# EAGLE design Sauna (EAGLE 9.5.1)
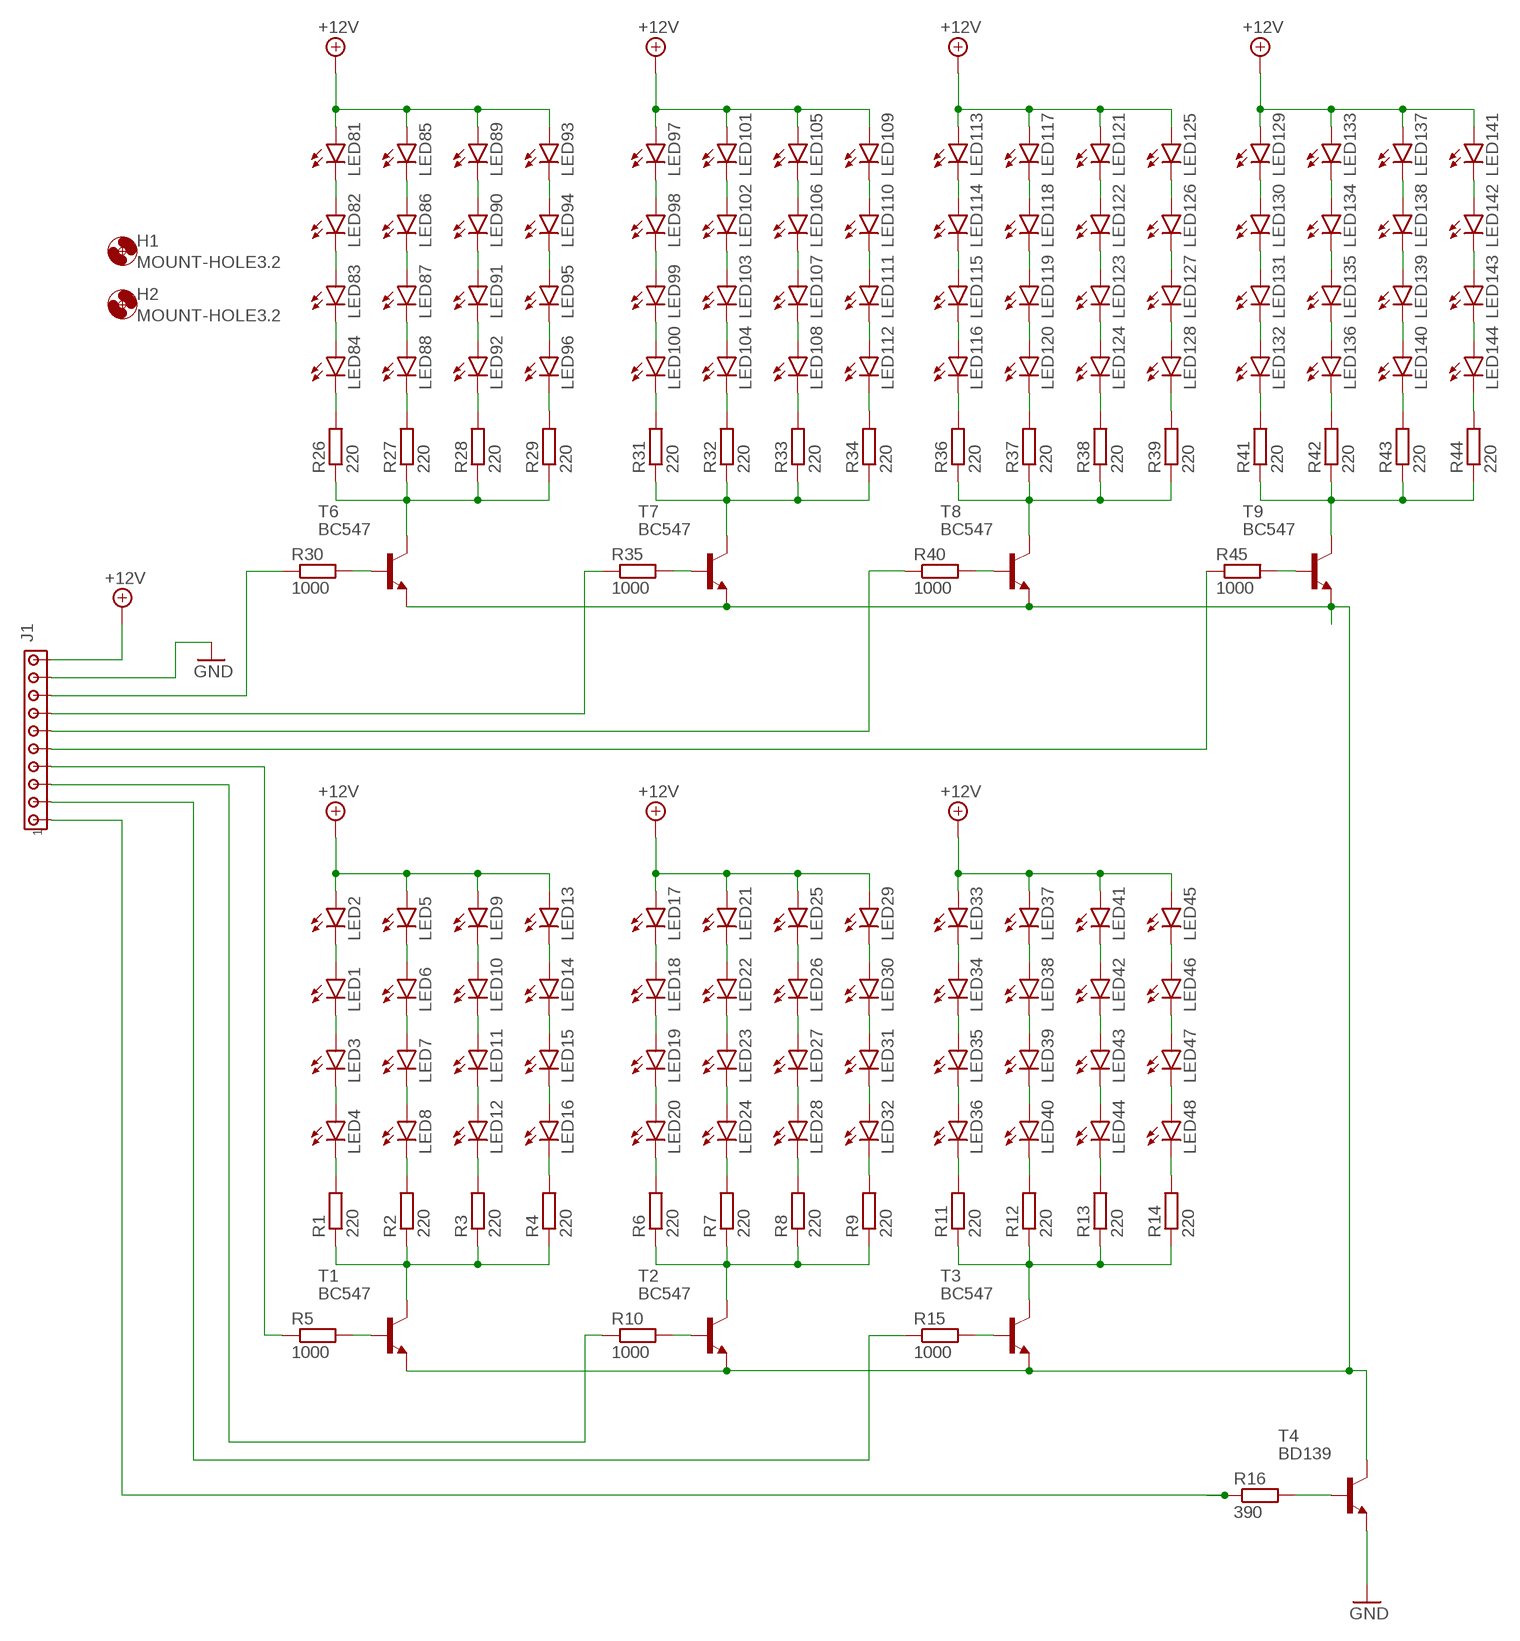
[diagram p0: schematic, sheet 1]

## Parts
H1  MOUNT-HOLE3.2  [3,2]
H2  MOUNT-HOLE3.2  [3,2]
J1  MTA10-100  [10X10MTA]
LED1  LED5MM  [LED5MM]
LED2  LED5MM  [LED5MM]
LED3  LED5MM  [LED5MM]
LED4  LED5MM  [LED5MM]
LED5  LED5MM  [LED5MM]
LED6  LED5MM  [LED5MM]
LED7  LED5MM  [LED5MM]
LED8  LED5MM  [LED5MM]
LED9  LED5MM  [LED5MM]
LED10  LED5MM  [LED5MM]
LED11  LED5MM  [LED5MM]
LED12  LED5MM  [LED5MM]
LED13  LED5MM  [LED5MM]
LED14  LED5MM  [LED5MM]
LED15  LED5MM  [LED5MM]
LED16  LED5MM  [LED5MM]
LED17  LED5MM  [LED5MM]
LED18  LED5MM  [LED5MM]
LED19  LED5MM  [LED5MM]
LED20  LED5MM  [LED5MM]
LED21  LED5MM  [LED5MM]
LED22  LED5MM  [LED5MM]
LED23  LED5MM  [LED5MM]
LED24  LED5MM  [LED5MM]
LED25  LED5MM  [LED5MM]
LED26  LED5MM  [LED5MM]
LED27  LED5MM  [LED5MM]
LED28  LED5MM  [LED5MM]
LED29  LED5MM  [LED5MM]
LED30  LED5MM  [LED5MM]
LED31  LED5MM  [LED5MM]
LED32  LED5MM  [LED5MM]
LED33  LED5MM  [LED5MM]
LED34  LED5MM  [LED5MM]
LED35  LED5MM  [LED5MM]
LED36  LED5MM  [LED5MM]
LED37  LED5MM  [LED5MM]
LED38  LED5MM  [LED5MM]
LED39  LED5MM  [LED5MM]
LED40  LED5MM  [LED5MM]
LED41  LED5MM  [LED5MM]
LED42  LED5MM  [LED5MM]
LED43  LED5MM  [LED5MM]
LED44  LED5MM  [LED5MM]
LED45  LED5MM  [LED5MM]
LED46  LED5MM  [LED5MM]
LED47  LED5MM  [LED5MM]
LED48  LED5MM  [LED5MM]
LED81  LED5MM  [LED5MM]
LED82  LED5MM  [LED5MM]
LED83  LED5MM  [LED5MM]
LED84  LED5MM  [LED5MM]
LED85  LED5MM  [LED5MM]
LED86  LED5MM  [LED5MM]
LED87  LED5MM  [LED5MM]
LED88  LED5MM  [LED5MM]
LED89  LED5MM  [LED5MM]
LED90  LED5MM  [LED5MM]
LED91  LED5MM  [LED5MM]
LED92  LED5MM  [LED5MM]
LED93  LED5MM  [LED5MM]
LED94  LED5MM  [LED5MM]
LED95  LED5MM  [LED5MM]
LED96  LED5MM  [LED5MM]
LED97  LED5MM  [LED5MM]
LED98  LED5MM  [LED5MM]
LED99  LED5MM  [LED5MM]
LED100  LED5MM  [LED5MM]
LED101  LED5MM  [LED5MM]
LED102  LED5MM  [LED5MM]
LED103  LED5MM  [LED5MM]
LED104  LED5MM  [LED5MM]
LED105  LED5MM  [LED5MM]
LED106  LED5MM  [LED5MM]
LED107  LED5MM  [LED5MM]
LED108  LED5MM  [LED5MM]
LED109  LED5MM  [LED5MM]
LED110  LED5MM  [LED5MM]
LED111  LED5MM  [LED5MM]
LED112  LED5MM  [LED5MM]
LED113  LED5MM  [LED5MM]
LED114  LED5MM  [LED5MM]
LED115  LED5MM  [LED5MM]
LED116  LED5MM  [LED5MM]
LED117  LED5MM  [LED5MM]
LED118  LED5MM  [LED5MM]
LED119  LED5MM  [LED5MM]
LED120  LED5MM  [LED5MM]
LED121  LED5MM  [LED5MM]
LED122  LED5MM  [LED5MM]
LED123  LED5MM  [LED5MM]
LED124  LED5MM  [LED5MM]
LED125  LED5MM  [LED5MM]
LED126  LED5MM  [LED5MM]
LED127  LED5MM  [LED5MM]
LED128  LED5MM  [LED5MM]
LED129  LED5MM  [LED5MM]
LED130  LED5MM  [LED5MM]
LED131  LED5MM  [LED5MM]
LED132  LED5MM  [LED5MM]
LED133  LED5MM  [LED5MM]
LED134  LED5MM  [LED5MM]
LED135  LED5MM  [LED5MM]
LED136  LED5MM  [LED5MM]
LED137  LED5MM  [LED5MM]
LED138  LED5MM  [LED5MM]
LED139  LED5MM  [LED5MM]
LED140  LED5MM  [LED5MM]
LED141  LED5MM  [LED5MM]
LED142  LED5MM  [LED5MM]
LED143  LED5MM  [LED5MM]
LED144  LED5MM  [LED5MM]
R1  220  R-EU_0207/10  [0207/10]
R2  220  R-EU_0207/10  [0207/10]
R3  220  R-EU_0207/10  [0207/10]
R4  220  R-EU_0207/10  [0207/10]
R5  1000  R-EU_0207/10  [0207/10]
R6  220  R-EU_0207/10  [0207/10]
R7  220  R-EU_0207/10  [0207/10]
R8  220  R-EU_0207/10  [0207/10]
R9  220  R-EU_0207/10  [0207/10]
R10  1000  R-EU_0207/10  [0207/10]
R11  220  R-EU_0207/10  [0207/10]
R12  220  R-EU_0207/10  [0207/10]
R13  220  R-EU_0207/10  [0207/10]
R14  220  R-EU_0207/10  [0207/10]
R15  1000  R-EU_0207/10  [0207/10]
R16  390  R-EU_0207/10  [0207/10]
R26  220  R-EU_0207/10  [0207/10]
R27  220  R-EU_0207/10  [0207/10]
R28  220  R-EU_0207/10  [0207/10]
R29  220  R-EU_0207/10  [0207/10]
R30  1000  R-EU_0207/10  [0207/10]
R31  220  R-EU_0207/10  [0207/10]
R32  220  R-EU_0207/10  [0207/10]
R33  220  R-EU_0207/10  [0207/10]
R34  220  R-EU_0207/10  [0207/10]
R35  1000  R-EU_0207/10  [0207/10]
R36  220  R-EU_0207/10  [0207/10]
R37  220  R-EU_0207/10  [0207/10]
R38  220  R-EU_0207/10  [0207/10]
R39  220  R-EU_0207/10  [0207/10]
R40  1000  R-EU_0207/10  [0207/10]
R41  220  R-EU_0207/10  [0207/10]
R42  220  R-EU_0207/10  [0207/10]
R43  220  R-EU_0207/10  [0207/10]
R44  220  R-EU_0207/10  [0207/10]
R45  1000  R-EU_0207/10  [0207/10]
T1  BC547  [TO92]
T2  BC547  [TO92]
T3  BC547  [TO92]
T4  BD139  [TO126]
T6  BC547  [TO92]
T7  BC547  [TO92]
T8  BC547  [TO92]
T9  BC547  [TO92]

## Nets
+12V: J1.10 LED2.A LED5.A LED9.A LED13.A LED17.A LED21.A LED25.A LED29.A LED33.A LED37.A LED41.A LED45.A LED81.A LED85.A LED89.A LED93.A LED97.A LED101.A LED105.A LED109.A LED113.A LED117.A LED121.A LED125.A LED129.A LED133.A LED137.A LED141.A
GND: J1.9 T4.1(E)
N$1: LED1.A LED2.K(C)
N$2: LED1.K(C) LED3.A
N$3: LED3.K(C) LED4.A
N$4: LED5.K(C) LED6.A
N$5: LED6.K(C) LED7.A
N$6: LED7.K(C) LED8.A
N$7: LED9.K(C) LED10.A
N$8: LED10.K(C) LED11.A
N$9: LED11.K(C) LED12.A
N$10: LED13.K(C) LED14.A
N$11: LED14.K(C) LED15.A
N$12: LED15.K(C) LED16.A
N$13: R16.2 T4.3(B)
N$14: LED16.K(C) R4.2
N$15: LED4.K(C) R1.2
N$16: LED8.K(C) R2.2
N$17: LED12.K(C) R3.2
N$18: R1.1 R2.1 R3.1 R4.1 T1.3(C)
N$19: R5.2 T1.2(B)
N$20: LED17.K(C) LED18.A
N$21: LED18.K(C) LED19.A
N$22: LED19.K(C) LED20.A
N$23: LED21.K(C) LED22.A
N$24: LED22.K(C) LED23.A
N$25: LED23.K(C) LED24.A
N$26: LED25.K(C) LED26.A
N$27: LED26.K(C) LED27.A
N$28: LED27.K(C) LED28.A
N$29: LED29.K(C) LED30.A
N$30: LED30.K(C) LED31.A
N$31: LED31.K(C) LED32.A
N$32: LED32.K(C) R9.2
N$33: LED20.K(C) R6.2
N$34: LED24.K(C) R7.2
N$35: LED28.K(C) R8.2
N$36: R6.1 R7.1 R8.1 R9.1 T2.3(C)
N$37: R10.2 T2.2(B)
N$38: LED33.K(C) LED34.A
N$39: LED34.K(C) LED35.A
N$40: LED35.K(C) LED36.A
N$41: LED37.K(C) LED38.A
N$42: LED38.K(C) LED39.A
N$43: LED39.K(C) LED40.A
N$44: LED41.K(C) LED42.A
N$45: LED42.K(C) LED43.A
N$46: LED43.K(C) LED44.A
N$47: LED45.K(C) LED46.A
N$48: LED46.K(C) LED47.A
N$49: LED47.K(C) LED48.A
N$50: LED48.K(C) R14.2
N$51: LED36.K(C) R11.2
N$52: LED40.K(C) R12.2
N$53: LED44.K(C) R13.2
N$54: R11.1 R12.1 R13.1 R14.1 T3.3(C)
N$55: R15.2 T3.2(B)
N$56: J1.2 R15.1
N$57: J1.8 R30.1
N$58: J1.1 R16.1
N$63: T1.1(E) T2.1(E) T3.1(E) T4.2(C) T6.1(E) T7.1(E) T8.1(E) T9.1(E)
N$92: LED81.K(C) LED82.A
N$93: LED82.K(C) LED83.A
N$94: LED83.K(C) LED84.A
N$95: LED85.K(C) LED86.A
N$96: LED86.K(C) LED87.A
N$97: LED87.K(C) LED88.A
N$98: LED89.K(C) LED90.A
N$99: LED90.K(C) LED91.A
N$100: LED91.K(C) LED92.A
N$101: LED93.K(C) LED94.A
N$102: LED94.K(C) LED95.A
N$103: LED95.K(C) LED96.A
N$104: LED96.K(C) R29.2
N$105: LED84.K(C) R26.2
N$106: LED88.K(C) R27.2
N$107: LED92.K(C) R28.2
N$108: R26.1 R27.1 R28.1 R29.1 T6.3(C)
N$109: R30.2 T6.2(B)
N$110: LED97.K(C) LED98.A
N$111: LED98.K(C) LED99.A
N$112: LED99.K(C) LED100.A
N$113: LED101.K(C) LED102.A
N$114: LED102.K(C) LED103.A
N$115: LED103.K(C) LED104.A
N$116: LED105.K(C) LED106.A
N$117: LED106.K(C) LED107.A
N$118: LED107.K(C) LED108.A
N$119: LED109.K(C) LED110.A
N$120: LED110.K(C) LED111.A
N$121: LED111.K(C) LED112.A
N$122: LED112.K(C) R34.2
N$123: LED100.K(C) R31.2
N$124: LED104.K(C) R32.2
N$125: LED108.K(C) R33.2
N$126: R31.1 R32.1 R33.1 R34.1 T7.3(C)
N$127: R35.2 T7.2(B)
N$128: LED113.K(C) LED114.A
N$129: LED114.K(C) LED115.A
N$130: LED115.K(C) LED116.A
N$131: LED117.K(C) LED118.A
N$132: LED118.K(C) LED119.A
N$133: LED119.K(C) LED120.A
N$134: LED121.K(C) LED122.A
N$135: LED122.K(C) LED123.A
N$136: LED123.K(C) LED124.A
N$137: LED125.K(C) LED126.A
N$138: LED126.K(C) LED127.A
N$139: LED127.K(C) LED128.A
N$140: LED128.K(C) R39.2
N$141: LED116.K(C) R36.2
N$142: LED120.K(C) R37.2
N$143: LED124.K(C) R38.2
N$144: R36.1 R37.1 R38.1 R39.1 T8.3(C)
N$145: R40.2 T8.2(B)
N$146: LED129.K(C) LED130.A
N$147: LED130.K(C) LED131.A
N$148: LED131.K(C) LED132.A
N$149: LED133.K(C) LED134.A
N$150: LED134.K(C) LED135.A
N$151: LED135.K(C) LED136.A
N$152: LED137.K(C) LED138.A
N$153: LED138.K(C) LED139.A
N$154: LED139.K(C) LED140.A
N$155: LED141.K(C) LED142.A
N$156: LED142.K(C) LED143.A
N$157: LED143.K(C) LED144.A
N$158: LED144.K(C) R44.2
N$159: LED132.K(C) R41.2
N$160: LED136.K(C) R42.2
N$161: LED140.K(C) R43.2
N$162: R41.1 R42.1 R43.1 R44.1 T9.3(C)
N$163: R45.2 T9.2(B)
N$164: J1.7 R35.1
N$165: J1.6 R40.1
N$167: J1.5 R45.1
N$168: J1.4 R5.1
N$169: J1.3 R10.1

## Library data of the parts
H1 H2 = holes:MOUNT-HOLE: MOUNTING HOLE with drill center marker
J1 = con-amp:MTA10-100: AMP connector
LED1-LED48 LED81-LED144 = led:LED: LED OSRAM: - CHIPLED LG R971, LG N971, LY N971, LG Q971, LY Q971, LO R971, LY R971 LH N974, LH R974 LS Q976, LO Q976, LY Q976 LO Q996 - Hyper CHIPLED LW Q18S LB Q993, LB Q99A, LB R99A - SideLED LS A670, LO A670, LY A670, LG A670, LP A670 LB A673, LV A673, LT A673, LW A673 LH A674 LY A675 LS A676, LA A676, LO A676, LY A676, LW A676 LS A679, LY A679, LG A679 - Hyper Micro SIDELED® LS Y876, LA Y876, LO Y876, LY Y876 LT Y87S - SmartLED LW L88C, LW L88S LB L89C, LB L89S, LG L890 LS L89K, LO L89K, LY L89K LS L896, LA L896, LO L896, LY L896 - TOPLED LS T670, LO T670, LY T670, LG T670, LP T670 LSG T670, LSP T670, LSY T670, LOP T670, LYG T670 LG T671, LOG T671, LSG T671 LB T673, LV T673, LT T673, LW T673 LH T674 LS T676, LA T676, LO T676, LY T676, LB T676, LH T676, LSB T676, LW T676 LB T67C, LV T67C, LT T67C, LS T67K, LO T67K, LY T67K, LW E67C LS E67B, LA E67B, LO E67B, LY E67B, LB E67C, LV E67C, LT E67C LW T67C LS T679, LY T679, LG T679 LS T770, LO T770, LY T770, LG T770, LP T770 LB T773, LV T773, LT T773, LW T773 LH T774 LS E675, LA E675, LY E675, LS T675 LS T776, LA T776, LO T776, LY T776, LB T776 LHGB T686 LT T68C, LB T68C - Hyper Mini TOPLED® LB M676 - Mini TOPLED Santana® LG M470 LS M47K, LO M47K, LY M47K Source: http://www.osram.convergy.de LUXEON: - LUMILED® LXK2-PW12-R00, LXK2-PW12-S00, LXK2-PW14-U00, LXK2-PW14-V00 LXK2-PM12-R00, LXK2-PM12-S00, LXK2-PM14-U00 LXK2-PE12-Q00, LXK2-PE12-R00, LXK2-PE12-S00, LXK2-PE14-T00, LXK2-PE14-U00 LXK2-PB12-K00, LXK2-PB12-L00, LXK2-PB12-M00, LXK2-PB14-N00, LXK2-PB14-P00, LXK2-PB14-Q00 LXK2-PR12-L00, LXK2-PR12-M00, LXK2-PR14-Q00, LXK2-PR14-R00 LXK2-PD12-Q00, LXK2-PD12-R00, LXK2-PD12-S00 LXK2-PH12-R00, LXK2-PH12-S00 LXK2-PL12-P00, LXK2-PL12-Q00, LXK2-PL12-R00 Source: www.luxeon.com KINGBRIGHT: KA-3528ASYC Source: www.kingbright.com
R1-R16 R26-R45 = rcl:R-EU_: RESISTOR, European symbol; SPICEPREFIX: R
T1-T3 T6-T9 = transistor:BC547: NPN TRANSISTOR
T4 = transistor:BD139: NPN TRANSISTOR

## Board
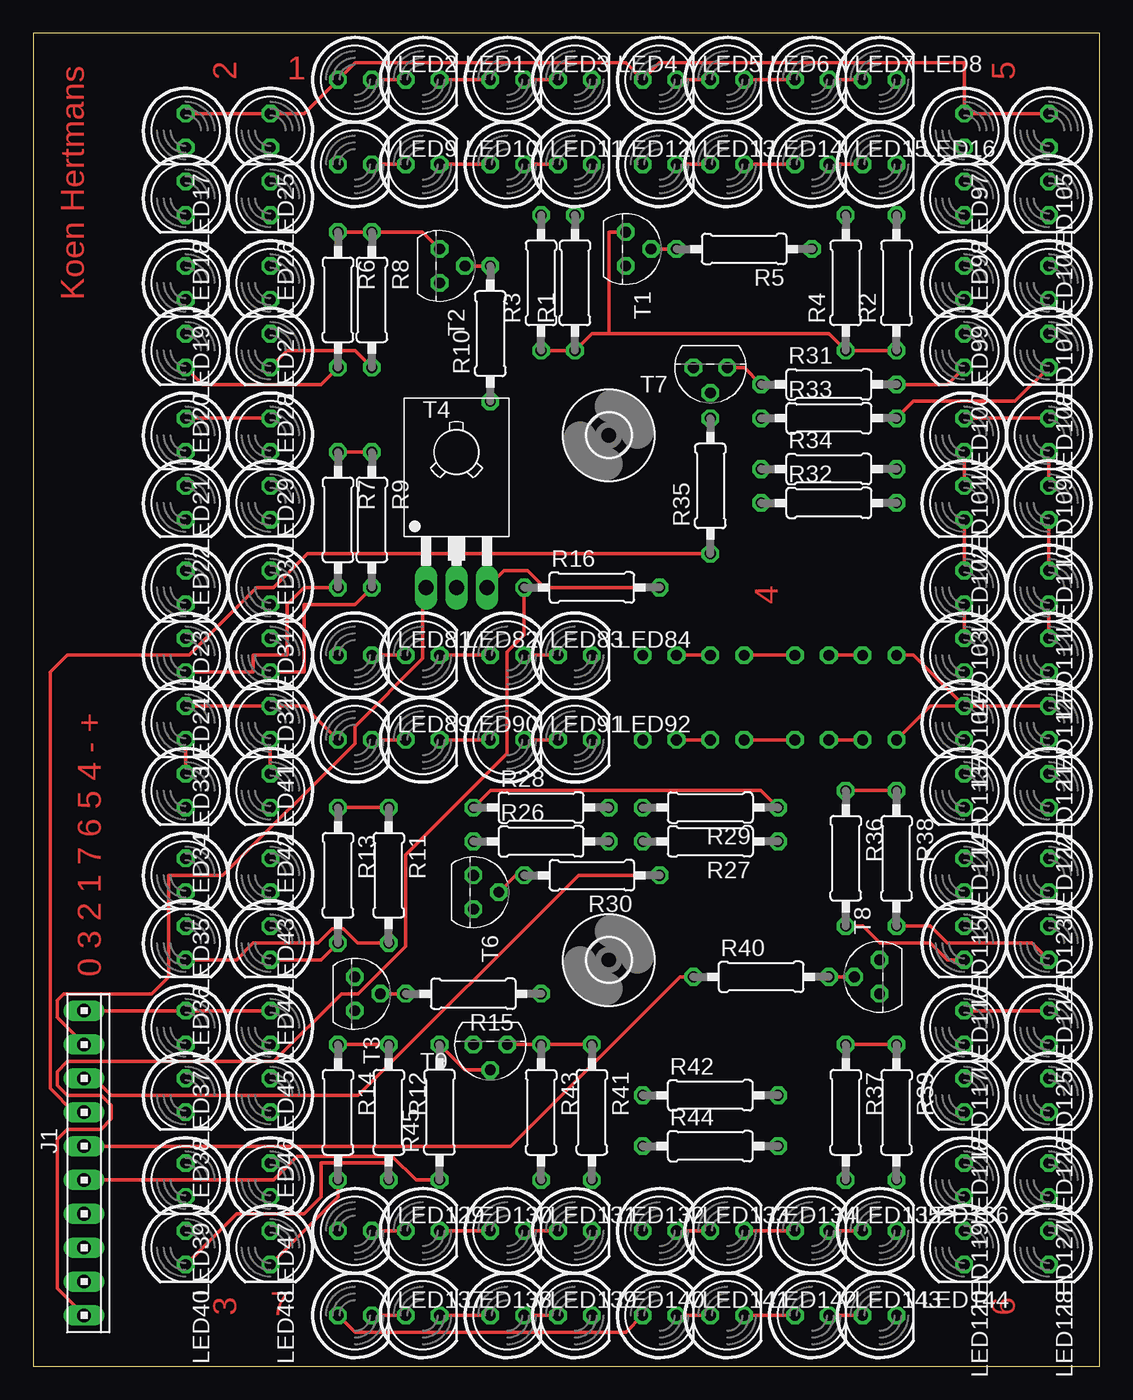
[diagram p1: board, top side]
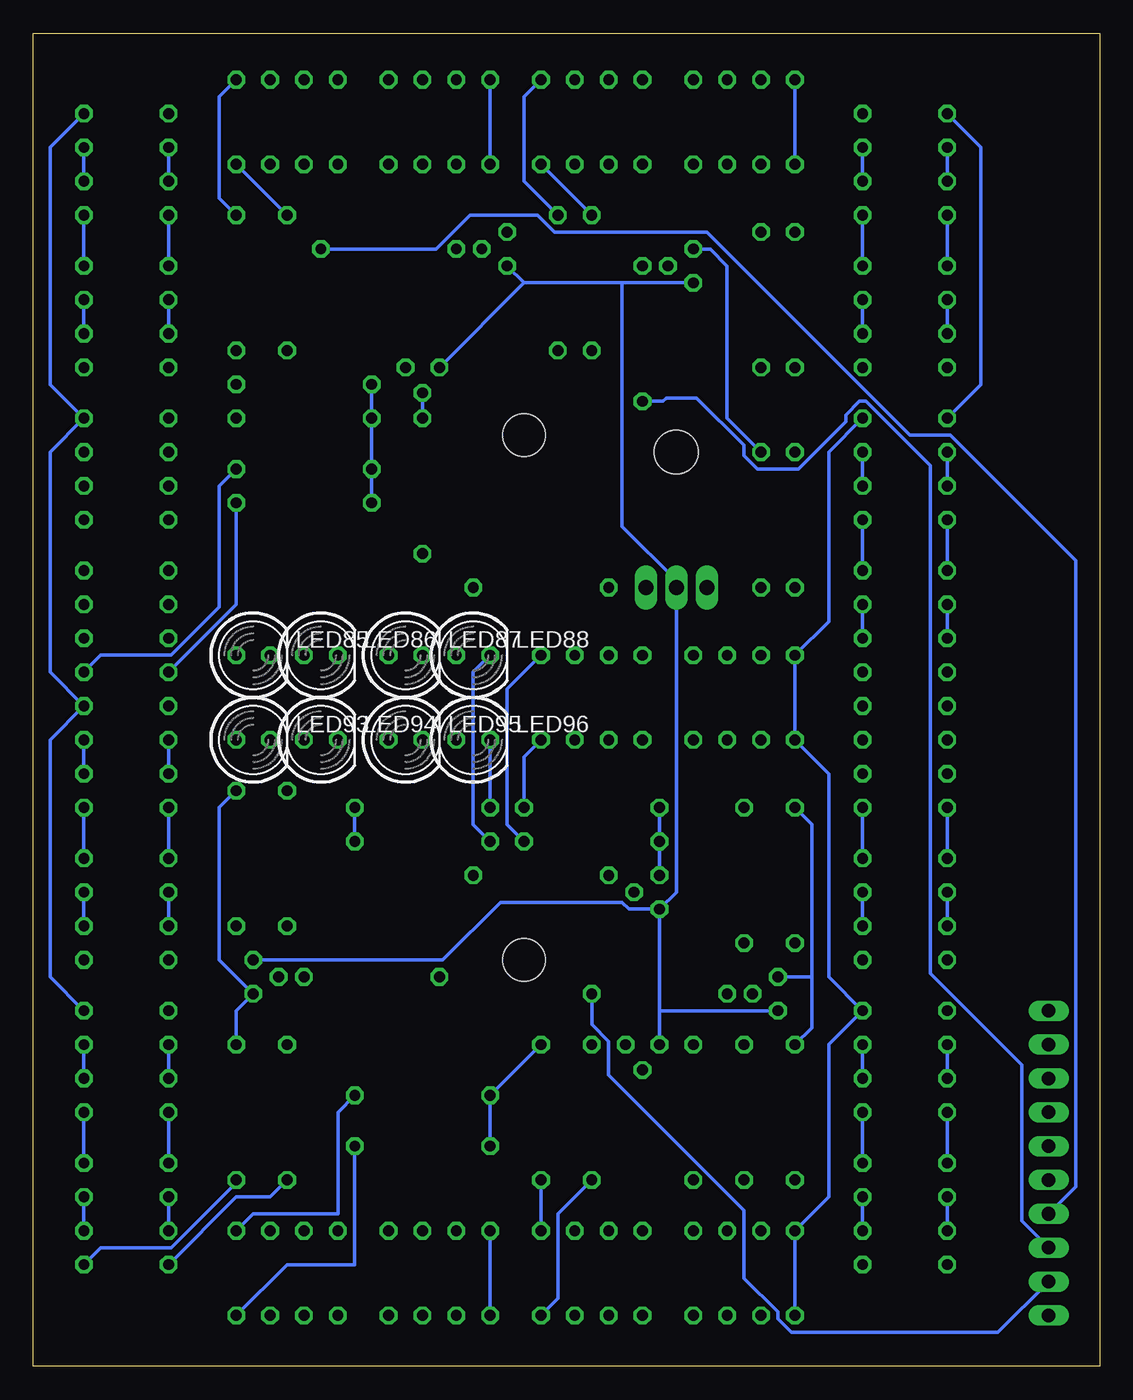
[diagram p2: board, bottom side, seen from below]

Size 80 x 100 mm. Coordinates in mm from the lower left corner, seen from the top.
Outline: 0,0 80,0 80,100 0,100 0,0
Copper layers (1*16): Top 0.035mm / dielectric 1.5mm / Bottom 0.035mm
Design rules "default *": minimum track width 10mil, minimum drill 0.35mm, track to track 10mil, track to pad 10mil, pad to pad 10mil, via to via 10mil, smd to smd 10mil, copper to edge 40mil, drill to drill 10mil, minimum pad ring 10mil, minimum via ring 8mil, stop-mask expansion 4mil, vias tented up to drill 0mil, thermal gap 10mil

### Footprints (pad centres in the part's own frame; a part is rotated, then mirrored left to right if it is on the bottom)
3,2 = hole 3.2: 0,0
10X10MTA = drill 1.016 long: 1 11.43,0; 2 8.89,0; 3 6.35,0; 4 3.81,0; 5 1.27,0; 6 -1.27,0; 7 -3.81,0; 8 -6.35,0; 9 -8.89,0; 10 -11.43,0
LED5MM = drill 0.813 octagon: A -1.27,0; K 1.27,0
0207/10 = drill 0.813 octagon: 1 -5.08,0; 2 5.08,0
TO92 = drill 0.813 octagon: 1 1.27,0; 2 0,1.905; 3 -1.27,0
TO126 = drill 1.118 long: 1 -2.286,-5.08; 2 0,-5.08; 3 2.286,-5.08 | hole 3.302: 0,5.08

### Placement (x,y rotation side)
H1  43.18,30.48 0 top
H2  43.18,69.85 0 top
J1  3.81,15.24 270 top
LED1  29.21,96.52 0 top
LED2  24.13,96.52 0 top
LED3  35.56,96.52 0 top
LED4  40.64,96.52 0 top
LED5  46.99,96.52 0 top
LED6  52.07,96.52 0 top
LED7  58.42,96.52 0 top
LED8  63.5,96.52 0 top
LED9  24.13,90.17 0 top
LED10  29.21,90.17 0 top
LED11  35.56,90.17 0 top
LED12  40.64,90.17 0 top
LED13  46.99,90.17 0 top
LED14  52.07,90.17 0 top
LED15  58.42,90.17 0 top
LED16  63.5,90.17 0 top
LED17  11.43,92.71 270 top
LED18  11.43,87.63 270 top
LED19  11.43,81.28 270 top
LED20  11.43,76.2 270 top
LED21  11.43,69.85 270 top
LED22  11.43,64.77 270 top
LED23  11.43,58.42 270 top
LED24  11.43,53.34 270 top
LED25  17.78,92.71 270 top
LED26  17.78,87.63 270 top
LED27  17.78,81.28 270 top
LED28  17.78,76.2 270 top
LED29  17.78,69.85 270 top
LED30  17.78,64.77 270 top
LED31  17.78,58.42 270 top
LED32  17.78,53.34 270 top
LED33  11.43,48.26 270 top
LED34  11.43,43.18 270 top
LED35  11.43,36.83 270 top
LED36  11.43,31.75 270 top
LED37  11.43,25.4 270 top
LED38  11.43,20.32 270 top
LED39  11.43,13.97 270 top
LED40  11.43,8.89 270 top
LED41  17.78,48.26 270 top
LED42  17.78,43.18 270 top
LED43  17.78,36.83 270 top
LED44  17.78,31.75 270 top
LED45  17.78,25.4 270 top
LED46  17.78,20.32 270 top
LED47  17.78,13.97 270 top
LED48  17.78,8.89 270 top
LED81  24.13,53.34 0 top
LED82  29.21,53.34 0 top
LED83  35.56,53.34 0 top
LED84  40.64,53.34 0 top
LED85  63.5,53.34 0 bottom
LED86  58.42,53.34 0 bottom
LED87  52.07,53.34 0 bottom
LED88  46.99,53.34 0 bottom
LED89  24.13,46.99 0 top
LED90  29.21,46.99 0 top
LED91  35.56,46.99 0 top
LED92  40.64,46.99 0 top
LED93  63.5,46.99 0 bottom
LED94  58.42,46.99 0 bottom
LED95  52.07,46.99 0 bottom
LED96  46.99,46.99 0 bottom
LED97  69.85,92.71 270 top
LED98  69.85,87.63 270 top
LED99  69.85,81.28 270 top
LED100  69.85,76.2 270 top
LED101  69.85,69.85 270 top
LED102  69.85,64.77 270 top
LED103  69.85,58.42 270 top
LED104  69.85,53.34 270 top
LED105  76.2,92.71 270 top
LED106  76.2,87.63 270 top
LED107  76.2,81.28 270 top
LED108  76.2,76.2 270 top
LED109  76.2,69.85 270 top
LED110  76.2,64.77 270 top
LED111  76.2,58.42 270 top
LED112  76.2,53.34 270 top
LED113  69.85,48.26 270 top
LED114  69.85,43.18 270 top
LED115  69.85,36.83 270 top
LED116  69.85,31.75 270 top
LED117  69.85,25.4 270 top
LED118  69.85,20.32 270 top
LED119  69.85,13.97 270 top
LED120  69.85,8.89 270 top
LED121  76.2,48.26 270 top
LED122  76.2,43.18 270 top
LED123  76.2,36.83 270 top
LED124  76.2,31.75 270 top
LED125  76.2,25.4 270 top
LED126  76.2,20.32 270 top
LED127  76.2,13.97 270 top
LED128  76.2,8.89 270 top
LED129  24.13,10.16 0 top
LED130  29.21,10.16 0 top
LED131  35.56,10.16 0 top
LED132  40.64,10.16 0 top
LED133  46.99,10.16 0 top
LED134  52.07,10.16 0 top
LED135  58.42,10.16 0 top
LED136  63.5,10.16 0 top
LED137  24.13,3.81 0 top
LED138  29.21,3.81 0 top
LED139  35.56,3.81 0 top
LED140  40.64,3.81 0 top
LED141  46.99,3.81 0 top
LED142  52.07,3.81 0 top
LED143  58.42,3.81 0 top
LED144  63.5,3.81 0 top
R1  40.64,81.28 90 top
R2  64.77,81.28 90 top
R3  38.1,81.28 90 top
R4  60.96,81.28 90 top
R5  53.34,83.82 180 top
R6  22.86,80.01 270 top
R7  22.86,63.5 270 top
R8  25.4,80.01 270 top
R9  25.4,63.5 270 top
R10  34.29,77.47 90 top
R11  26.67,36.83 270 top
R12  26.67,19.05 270 top
R13  22.86,36.83 270 top
R14  22.86,19.05 270 top
R15  33.02,27.94 180 top
R16  41.91,58.42 0 top
R26  38.1,39.37 0 top
R27  50.8,39.37 180 top
R28  38.1,41.91 0 top
R29  50.8,41.91 180 top
R30  41.91,36.83 180 top
R31  59.69,73.66 0 top
R32  59.69,64.77 0 top
R33  59.69,71.12 0 top
R34  59.69,67.31 0 top
R35  50.8,66.04 90 top
R36  60.96,38.1 270 top
R37  60.96,19.05 270 top
R38  64.77,38.1 270 top
R39  64.77,19.05 270 top
R40  54.61,29.21 0 top
R41  41.91,19.05 270 top
R42  50.8,20.32 0 top
R43  38.1,19.05 270 top
R44  50.8,16.51 0 top
R45  30.48,19.05 90 top
T1  44.45,83.82 270 top
T2  30.48,82.55 270 top
T3  24.13,27.94 270 top
T4  31.75,63.5 0 top
T6  33.02,35.56 270 top
T7  50.8,74.93 180 top
T8  63.5,29.21 90 top
T9  34.29,24.13 180 top

### Tracks (layer width: path | path; a pad name or v marks a point on that pad's centre or on a via)
+12V
  Top 0.254: LED17.A LED25.A 20.32,93.98 LED2.A 24.13,97.79 44.45,97.79 LED5.A 46.99,97.79 69.85,97.79 LED97.A LED105.A | LED21.A LED29.A | LED33.A LED41.A 20.32,49.53 LED89.A | LED45.A LED37.A J1.10 | LED85.A 66.04,53.34 LED113.A | LED121.A LED113.A | LED93.A 67.31,49.53 LED113.A | LED101.A LED109.A | LED125.A LED117.A | LED137.A 24.13,2.54 44.45,2.54 LED141.A
  Bottom 0.254: LED2.A LED9.A | LED5.A LED13.A | LED17.A 8.89,91.44 8.89,73.66 LED21.A | LED29.A 20.32,68.58 20.32,55.88 LED81.A LED89.A 20.32,44.45 20.32,29.21 LED45.A 20.32,24.13 20.32,12.7 LED129.A LED137.A | LED105.A 78.74,91.44 78.74,73.66 LED109.A 78.74,68.58 78.74,52.07 LED121.A 78.74,46.99 78.74,29.21 LED125.A | LED133.A LED141.A
GND
  Top 0.254: J1.9 1.78,26.16 1.78,27.43 2.29,27.94 8.89,27.94 10.16,29.21 10.16,36.83 11.18,36.83 11.43,36.83 14.22,36.83 24.13,46.74 24.13,48.01 29.21,53.09 29.21,58.17 T4.1
N$1
  Top 0.254: LED2.K LED1.A
N$2
  Top 0.254: LED1.K LED3.A
N$3
  Top 0.254: LED3.K LED4.A
N$4
  Top 0.254: LED5.K LED6.A
N$5
  Top 0.254: LED6.K LED7.A
N$6
  Top 0.254: LED7.K LED8.A
N$7
  Top 0.254: LED9.K LED10.A
N$8
  Top 0.254: LED10.K LED11.A
N$9
  Top 0.254: LED11.K LED12.A
N$10
  Top 0.254: LED13.K LED14.A
N$11
  Top 0.254: LED14.K LED15.A
N$12
  Top 0.254: LED15.K LED16.A
N$13
  Top 0.254: R16.2 38.35,58.42 37.08,59.69 35.31,59.69 T4.3
N$14
  Bottom 0.254: R4.2 LED16.K
N$15
  Bottom 0.254: LED4.K 43.18,95.25 43.18,88.9 R1.2
N$16
  Bottom 0.254: LED8.K 66.04,95.25 66.04,87.63 R2.2
N$17
  Bottom 0.254: LED12.K R3.2
N$18
  Top 0.254: R3.1 R1.1 41.91,77.47 43.18,77.47 | R2.1 R4.1 59.69,77.47 43.18,77.47 | 43.18,77.47 43.18,85.09 T1.3
N$19
  Top 0.254: T1.2 R5.2
N$20
  Bottom 0.254: LED17.K LED18.A
N$21
  Bottom 0.254: LED18.K LED19.A
N$22
  Bottom 0.254: LED19.K LED20.A
N$23
  Bottom 0.254: LED21.K LED22.A
N$24
  Bottom 0.254: LED22.K LED23.A
N$25
  Bottom 0.254: LED23.K LED24.A
N$26
  Bottom 0.254: LED25.K LED26.A
N$27
  Bottom 0.254: LED26.K LED27.A
N$28
  Bottom 0.254: LED27.K LED28.A
N$29
  Bottom 0.254: LED29.K LED30.A
N$30
  Bottom 0.254: LED30.K LED31.A
N$31
  Bottom 0.254: LED31.K LED32.A
N$32
  Top 0.254: LED32.K 20.32,52.07 20.32,57.15 24.13,57.15 R9.2
N$33
  Top 0.254: LED20.K 12.7,73.66 21.59,73.66 R6.2
N$34
  Top 0.254: R7.2 20.32,58.42 19.05,57.15 19.05,53.34 16.51,53.34 16.51,52.07 LED24.K
N$35
  Top 0.254: LED28.K 19.05,76.2 24.13,76.2 R8.2
N$36
  Top 0.254: R6.1 R8.1 29.21,85.09 T2.3 | R7.1 R9.1
  Bottom 0.254: R9.1 27.94,71.12 27.94,82.55 29.21,83.82 T2.3
N$37
  Top 0.254: T2.2 R10.2
N$38
  Top 0.254: LED33.K LED34.A
N$39
  Bottom 0.254: LED35.A LED34.K
N$40
  Bottom 0.254: LED36.A LED35.K
N$41
  Bottom 0.254: LED38.A LED37.K
N$42
  Bottom 0.254: LED39.A LED38.K
N$43
  Bottom 0.254: LED40.A LED39.K
N$44
  Top 0.254: LED41.K LED42.A
N$45
  Bottom 0.254: LED43.A LED42.K
N$46
  Bottom 0.254: LED44.A LED43.K
N$47
  Bottom 0.254: LED46.A LED45.K
N$48
  Bottom 0.254: LED47.A LED46.K
N$49
  Bottom 0.254: LED48.A LED47.K
N$50
  Top 0.254: LED48.K 22.86,12.7 R14.2
N$51
  Top 0.254: LED36.K 15.24,30.48 16.51,31.75 21.39,31.75 22.43,32.79 23.29,32.79 24.33,31.75 R11.2
N$52
  Top 0.254: LED40.K 15.24,11.43 20.32,11.43 21.59,12.7 21.59,15.24 26.67,15.24 R12.2
N$53
  Top 0.254: LED44.K 21.59,30.48 R13.2
N$54
  Top 0.254: R13.1 R11.1 | R14.1 R12.1
  Bottom 0.254: R14.1 21.59,25.4 21.59,29.21 | R13.1 21.59,40.64 21.59,29.21 | 21.59,29.21 T3.3
N$55
  Top 0.254: T3.2 R15.2
N$56
  Bottom 0.254: R15.1 38.1,25.65 36.83,24.38 36.83,21.84 26.67,11.68 26.67,6.6 24.13,4.06 24.13,3.56 23.11,2.54 7.62,2.54 J1.2
N$57
  Top 0.254: R30.1 40.89,36.83 24.38,20.32 5.84,20.32 4.57,21.59 J1.8
N$58
  Top 0.254: R16.1 36.83,54.86 35.56,53.59 35.56,45.97 27.94,38.35 27.94,31.5 24.38,27.94 23.11,27.94 18.03,22.86 2.54,22.86 1.78,22.1 1.78,21.08 2.54,20.32 5.08,20.32 5.84,19.56 5.84,18.54 5.08,17.78 2.54,17.78 1.78,17.02 1.78,5.84 J1.1
N$63
  Bottom 0.254: 43.18,81.28 35.81,81.28 | 35.81,81.28 T2.1 | T1.1 43.18,81.28 | 43.18,81.28 T7.1 | T6.1 33.02,26.67 | 33.02,26.67 T9.1 | 33.02,26.67 T3.1 | T8.1 49.28,30.48 44.96,34.8 35.81,34.8 35.31,34.29 T6.1 | T6.1 31.75,35.56 T4.2 31.75,58.93 35.81,62.99 35.81,81.28
N$92
  Top 0.254: LED81.K LED82.A
N$93
  Top 0.254: LED82.K LED83.A
N$94
  Top 0.254: LED83.K LED84.A
N$95
  Top 0.254: LED86.A LED85.K
N$96
  Top 0.254: LED87.A LED86.K
N$97
  Top 0.254: LED88.A LED87.K
N$98
  Top 0.254: LED89.K LED90.A
N$99
  Top 0.254: LED90.K LED91.A
N$100
  Top 0.254: LED91.K LED92.A
N$101
  Top 0.254: LED94.A LED93.K
N$102
  Top 0.254: LED95.A LED94.K
N$103
  Top 0.254: LED96.A LED95.K
N$104
  Bottom 0.254: LED96.K R29.2
N$105
  Bottom 0.254: LED84.K 44.45,50.8 44.45,40.64 R26.2
N$106
  Bottom 0.254: LED88.K 46.99,52.07 46.99,40.64 R27.2
N$107
  Bottom 0.254: LED92.K 43.18,45.72 R28.2
N$108
  Top 0.254: R28.1 34.29,43.18 54.61,43.18 R29.1
  Bottom 0.254: R28.1 R26.1 T6.3 | R27.1 R29.1
N$109
  Top 0.254: R30.2 36.2,36.83 T6.2
N$110
  Bottom 0.254: LED97.K LED98.A
N$111
  Bottom 0.254: LED99.A LED98.K
N$112
  Bottom 0.254: LED100.A LED99.K
N$113
  Top 0.254: LED101.K LED102.A
N$114
  Top 0.254: LED102.K LED103.A
N$115
  Top 0.254: LED103.K LED104.A
N$116
  Bottom 0.254: LED105.K LED106.A
N$117
  Bottom 0.254: LED107.A LED106.K
N$118
  Bottom 0.254: LED108.A LED107.K
N$119
  Top 0.254: LED109.K LED110.A
N$120
  Top 0.254: LED110.K LED111.A
N$121
  Top 0.254: LED111.K LED112.A
N$122
  Bottom 0.254: R34.2 66.04,66.04 66.04,56.95 69.65,53.34 74.93,53.34 LED112.K
N$123
  Top 0.254: LED100.K 68.58,73.66 R31.2
N$124
  Bottom 0.254: R32.2 64.77,57.15 LED104.K
N$125
  Top 0.254: R33.2 66.04,72.39 73.66,72.39 LED108.K
N$126
  Top 0.254: R31.1 53.34,74.93 T7.3
  Bottom 0.254: R32.1 R34.1 R33.1 R31.1
N$127
  Bottom 0.254: T7.2 R35.2
N$128
  Bottom 0.254: LED114.A LED113.K
N$129
  Bottom 0.254: LED115.A LED114.K
N$130
  Bottom 0.254: LED116.A LED115.K
N$131
  Bottom 0.254: LED117.K LED118.A
N$132
  Bottom 0.254: LED118.K LED119.A
N$133
  Bottom 0.254: LED119.K LED120.A
N$134
  Bottom 0.254: LED122.A LED121.K
N$135
  Bottom 0.254: LED123.A LED122.K
N$136
  Bottom 0.254: LED124.A LED123.K
N$137
  Bottom 0.254: LED125.K LED126.A
N$138
  Bottom 0.254: LED126.K LED127.A
N$139
  Bottom 0.254: LED127.K LED128.A
N$140
  Bottom 0.254: LED128.K 74.93,8.89 69.65,8.89 65,13.54 65,13.74 R39.2
N$141
  Top 0.254: R36.2 62.23,33.02 63.5,31.75 67.31,31.75 68.58,30.48 LED116.K
N$142
  Bottom 0.254: R37.2 62.23,12.7 64.77,12.7 LED120.K
N$143
  Top 0.254: R38.2 67.31,33.02 68.58,31.75 74.93,31.75 LED124.K
N$144
  Top 0.254: R39.1 R37.1 | R38.1 R36.1
  Bottom 0.254: R38.1 66.04,41.91 66.04,30.48 T8.3 64.77,26.67 R39.1
N$145
  Top 0.254: T8.2 R40.2
N$146
  Top 0.254: LED129.K LED130.A
N$147
  Top 0.254: LED130.K LED131.A
N$148
  Top 0.254: LED131.K LED132.A
N$149
  Top 0.254: LED133.K LED134.A
N$150
  Top 0.254: LED134.K LED135.A
N$151
  Top 0.254: LED135.K LED136.A
N$152
  Top 0.254: LED137.K LED138.A
N$153
  Top 0.254: LED138.K LED139.A
N$154
  Top 0.254: LED139.K LED140.A
N$155
  Top 0.254: LED141.K LED142.A
N$156
  Top 0.254: LED142.K LED143.A
N$157
  Top 0.254: LED143.K LED144.A
N$158
  Bottom 0.254: LED144.K 60.96,7.62 55.88,7.62 R44.2
N$159
  Bottom 0.254: R41.2 LED132.K
N$160
  Bottom 0.254: LED136.K 63.5,11.43 57.15,11.43 57.15,19.05 R42.2
N$161
  Bottom 0.254: LED140.K 40.64,5.08 40.64,11.43 R43.2
N$162
  Top 0.254: R41.1 R43.1 T9.3
  Bottom 0.254: R44.1 R42.1 R41.1
N$163
  Top 0.254: T9.2 32.38,22.23 R45.2
N$164
  Top 0.254: R35.1 20.57,60.96 18.03,58.42 16.76,58.42 11.68,53.34 11.43,53.34 11.18,53.34 2.54,53.34 1.27,52.07 1.27,43.43 1.27,43.18 1.27,20.83 3.05,19.05 J1.7
N$165
  Top 0.254: R40.1 48.51,29.21 35.81,16.51 J1.6
N$167
  Top 0.254: R45.1 28.7,13.97 26.92,15.75 19.81,15.75 18.03,13.97 J1.5
N$168
  Bottom 0.254: R5.1 49.78,83.82 47.24,86.36 42.16,86.36 40.89,85.09 29.46,85.09 14.22,69.85 11.18,69.85 1.78,60.45 1.78,13.46 J1.4
N$169
  Bottom 0.254: R10.1 32.77,72.39 32.51,72.64 30.23,72.64 26.67,69.09 26.67,68.33 25.65,67.31 22.61,67.31 19.05,70.87 19.05,71.37 18.03,72.39 17.53,72.39 12.7,67.56 12.7,29.46 5.84,22.61 5.84,10.92 J1.3

### Text on the board
Top: 2 | 1 | 5 | Koen Hertmans | 4 | 0 3 2 1 7 6 5 4 - + | 3 | 7 | 6